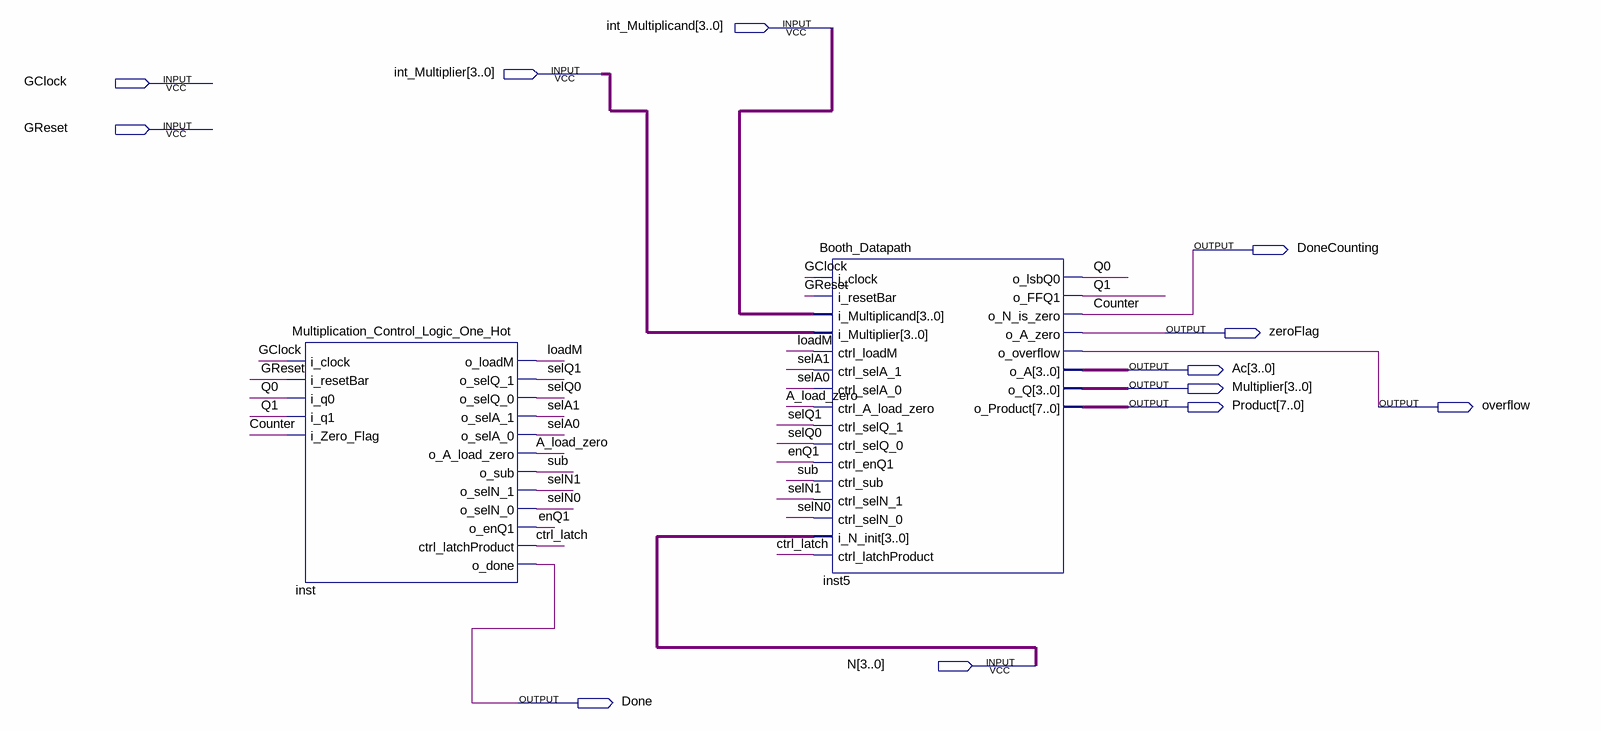
[diagram p0: schematic sheet]
// Quartus schematic Multiplication.bdf as structural Verilog: 2 symbols, 12 pins
module Multiplication (
  input  [3:0] int_Multiplicand,
  input  [3:0] int_Multiplier,
  input  GClock,
  input  GReset,
  input  [3:0] N,
  output DoneCounting,
  output zeroFlag,
  output [3:0] Ac,
  output [3:0] Multiplier,
  output [7:0] Product,
  output overflow,
  output Done
);

  wire A_load_zero, ctrl_latch, enQ1, loadM, Q0, Q1, selA0, selA1, selN0, selN1, selQ0, selQ1, sub;

  Multiplication_Control_Logic_One_Hot inst (
    .i_clock(GClock), .i_resetBar(GReset), .i_q0(Q0), .i_q1(Q1), .i_Zero_Flag(DoneCounting), .o_loadM(loadM),
    .o_selQ_1(selQ1), .o_selQ_0(selQ0), .o_selA_1(selA1), .o_selA_0(selA0), .o_A_load_zero(A_load_zero),
    .o_sub(sub), .o_selN_1(selN1), .o_selN_0(selN0), .o_enQ1(enQ1), .ctrl_latchProduct(ctrl_latch),
    .o_done(Done));
  Booth_Datapath inst5 (
    .i_clock(GClock), .i_resetBar(GReset), .i_Multiplicand(int_Multiplicand), .i_Multiplier(int_Multiplier),
    .ctrl_loadM(loadM), .ctrl_selA_1(selA1), .ctrl_selA_0(selA0), .ctrl_A_load_zero(A_load_zero),
    .ctrl_selQ_1(selQ1), .ctrl_selQ_0(selQ0), .ctrl_enQ1(enQ1), .ctrl_sub(sub), .ctrl_selN_1(selN1),
    .ctrl_selN_0(selN0), .i_N_init(N), .ctrl_latchProduct(ctrl_latch), .o_lsbQ0(Q0), .o_FFQ1(Q1),
    .o_N_is_zero(DoneCounting), .o_A_zero(zeroFlag), .o_overflow(overflow), .o_A(Ac), .o_Q(Multiplier),
    .o_Product(Product));

  // Other names for the same wires on the sheet: Counter = DoneCounting
endmodule
